# EAGLE schematic power mux-v5 (EAGLE 6.5.0)
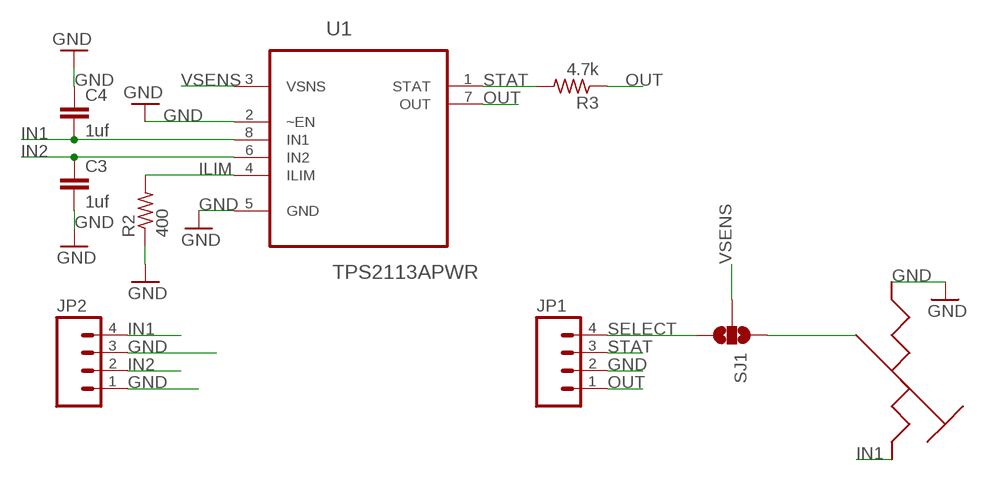
[diagram p0: schematic, sheet 1]

## Parts
C3  1uf  CAP0402-CAP  [0402-CAP]
C4  1uf  CAP0402-CAP  [0402-CAP]
JP1  M04PTH  [1X04]
JP2  M04PTH  [1X04]
R2  400  R-US_R0402  [R0402]
R3  4.7k  R-US_R0402  [R0402]
SJ1  SOLDERJUMPER_2WAYPASTE1&2  [SJ_3_PASTE1&2]
U1  TPS2113APWR  [SOP65P640X120-8N]
U$2  TRIMPOT-10K  [TRIMPOT-10K]

## Nets
GND: C3.2 C4.1 JP1.2 JP2.1 JP2.3 R2.1 U1.2(~EN) U1.5(GND) U$2.1(IN)
ILIM: R2.2 U1.4(ILIM)
IN1: C4.2 JP2.4 U1.8(IN1) U$2.2(OUT)
IN2: C3.1 JP2.2 U1.6(IN2)
N$2: SJ1.1 U$2.3(W)
OUT: JP1.1 R3.1 U1.7(OUT)
SELECT: JP1.4 SJ1.3
STAT: JP1.3 R3.2 U1.1(STAT)
VSENS: SJ1.2 U1.3(VSNS)

## Library data of the parts
C3 C4 = SparkFun-Capacitors:CAP: Capacitor Standard 0603 ceramic capacitor, and 0.1" leaded capacitor.
JP1 JP2 = SparkFun-Connectors:M04: Header 4 Standard 4-pin 0.1" header. Use with straight break away headers (SKU : PRT-00116), right angle break away headers (PRT-00553), swiss pins (PRT-00743), machine pins (PRT-00117), and female headers (PRT-00115). Molex polarized connector foot print use with SKU : PRT-08231 with associated crimp pins and housings. 1MM SMD Version SKU: PRT-10208
R2 R3 = resistor:R-US_: RESISTOR, American symbol
SJ1 = SparkFun-Passives:SOLDERJUMPER_2WAY: Solder Jumper 2 way solder jumper
U1 = Texas Instruments_By_element14_Batch_1:TPS2113APWR: AUTOSWITCHING POWER MUX; MPN: TPS2113APWR; OC_FARNELL: 1757288; OC_NEWARK: 01J0961; PACKAGE: TSSOP-8; SUPPLIER: TEXAS INSTRUMENTS
U$2 = Richards:TRIMPOT-10K